# Altium schematic sheet EEG_Power_Connector_ESP32.SchDoc
size A4
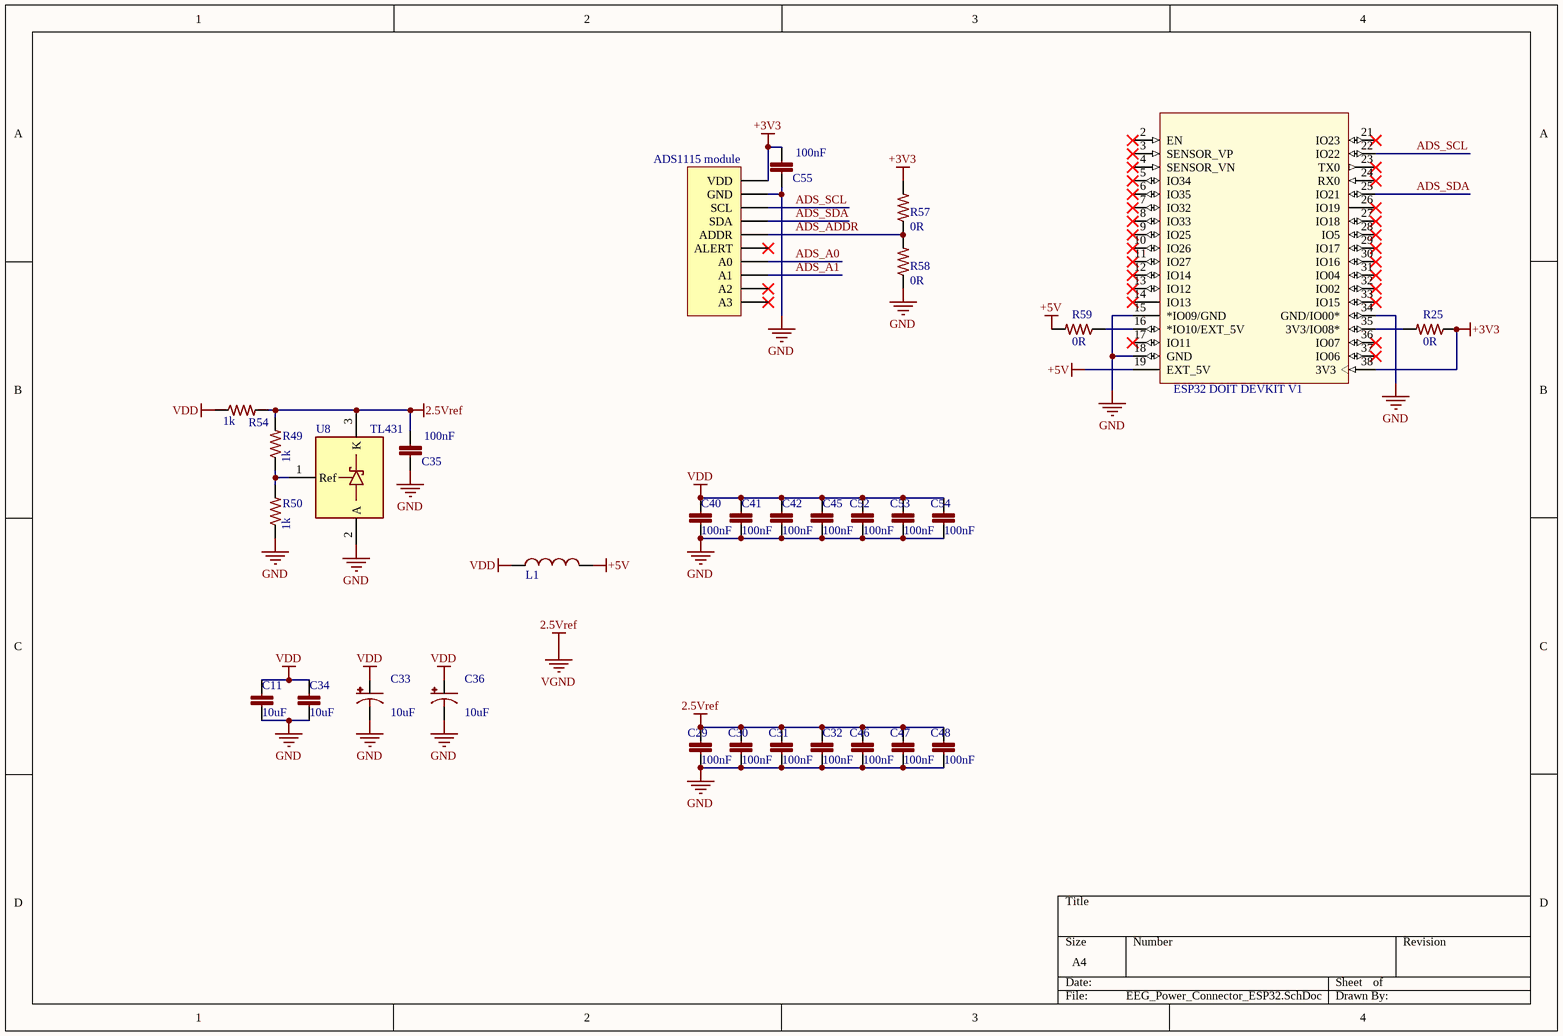
[diagram p0: EEG_Power_Connector_ESP32.SchDoc]

## Parts
A2  ESP32 DOIT DEVKIT V1  [MODULE_ESP32-DOIT_DEVKIT-36P]
A4  ADS1115 module  [ADS1115 Module - horizontal]
C11  10uF  [C0805 - rounded]
C29  100nF  [C0805 - rounded]
C30  100nF  [C0805 - rounded]
C31  100nF  [C0805 - rounded]
C32  100nF  [C0805 - rounded]
C33  10uF  [E1,8-4]
C34  10uF  [C0805 - rounded]
C35  100nF  [C0805 - rounded]
C36  10uF  [E1,8-4]
C40  100nF  [C0805 - rounded]
C41  100nF  [C0805 - rounded]
C42  100nF  [C0805 - rounded]
C45  100nF  [C0805 - rounded]
C46  100nF  [C0805 - rounded]
C47  100nF  [C0805 - rounded]
C48  100nF  [C0805 - rounded]
C52  100nF  [C0805 - rounded]
C53  100nF  [C0805 - rounded]
C54  100nF  [C0805 - rounded]
C55  100nF  [C0805 - rounded]
L1  Ferrite bead 0603  [L0805]  (value not drawn)
R25  0R  [R0805 - rounded]
R49  1k  [C0805]
R50  1k  [C0805]
R54  1k  [R0805 - rounded]
R57  0R  [R0805 - rounded]
R58  0R  [R0805 - rounded]
R59  0R  [R0805 - rounded]
U8  TL431  [TO92 - TL431]

## Nets
2.5Vref: C29.2 C30.2 C31.2 C32.2 C35.2 C46.2 C47.2 C48.2 R49.2 R54.2 U8.3(K)  [also labelled VGND]
+3V3: A2.38(3V3) A4.1(VDD) C55.1 R25.1 R57.2
+5V: A2.19(EXT_5V) L1.2 R59.2
GND: A2.15(*IO09/GND) A2.18(GND) A2.34(GND/IO00*) A4.2(GND) C11.1 C29.1 C30.1 C31.1 C32.1 C33.- C34.1 C35.1 C36.- C40.1 C41.1 C42.1 C45.1 C46.1 C47.1 C48.1 C52.1 C53.1 C54.1 C55.2 R50.1 R58.1 U8.2(A)
VDD: C11.2 C33.+ C34.2 C36.+ C40.2 C41.2 C42.2 C45.2 C52.2 C53.2 C54.2 L1.1 R54.1
ADS_A0: A4.7(A0)
ADS_A1: A4.8(A1)
ADS_ADDR: A4.5(ADDR) R57.1 R58.2
ADS_SCL: A2.22(IO22) A4.3(SCL)
ADS_SDA: A2.25(IO21) A4.4(SDA)
NetA2_16: A2.16(*IO10/EXT_5V) R59.1
NetA2_35: A2.35(3V3/IO08*) R25.2
NetR49_1: R49.1 R50.2 U8.1(Ref)

Not connected (* = marked no-connect by the designer): A2 2(EN)* 3(SENSOR_VP)* 4(SENSOR_VN)* 5(IO34)* 6(IO35)* 7(IO32)* 8(IO33)* 9(IO25)* 10(IO26)* 11(IO27)* 12(IO14)* 13(IO12)* 14(IO13)* 17(IO11)* 21(IO23)* 23(TX0)* 24(RX0)* 26(IO19)* 27(IO18)* 28(IO5)* 29(IO17)* 30(IO16)* 31(IO04)* 32(IO02)* 33(IO15)* 36(IO07)* 37(IO06)*; A4 6(ALERT)* 9(A2)* 10(A3)*

## Library data of the parts
A2 = ESP32-DEVKITC-38/38P: EVAL BOARD FOR ESP-WROOM-32; MP: ESP32-DEVKITC-32D; MF: Espressif Systems; SnapEDA_Link: https://www.snapeda.com/parts/ESP32-DEVKITC-32D/Espressif%20Systems/view-part/?ref=snap; Digi-Key_Part_Number: 1965-1000-ND; Digi-Key_Purchase_URL: https://www.digikey.tw/product-detail/en/espressif-systems/ESP32-DEVKITC-32D/1965-1000-ND/9356990?utm_source=snapeda&utm_medium=aggregator&utm_campaign=symbol; Package: None; Value: *
A4 = ADS1115 module: 16Bit I2C ADC+PGA; Vendor: Adafruit; Part Number: ADS1115 module
C11 C29-C32 C34 C35 C40-C42 C45-C48 C52-C55 = C-EU-SMD: Generic Capacitor SMD
  C11 C34: Value: 10uF
  C29-C32 C35 C40-C42 C45-C48 C52-C55: Value: 100nF
C33 C36 = CPOL-US-PTH: Genereric Polarized Capacitor PTH; Value: 10uF
L1 = L-US0805
R25 R49 R50 R54 R57-R59 = R-US-SMD: Generic Resistor SMD
  R25 R57-R59: Value: 0R
  R49 R50 R54: Value: 1k
U8 = TL431: Voltage References Rail Virtual Ground; Part Number: TL431